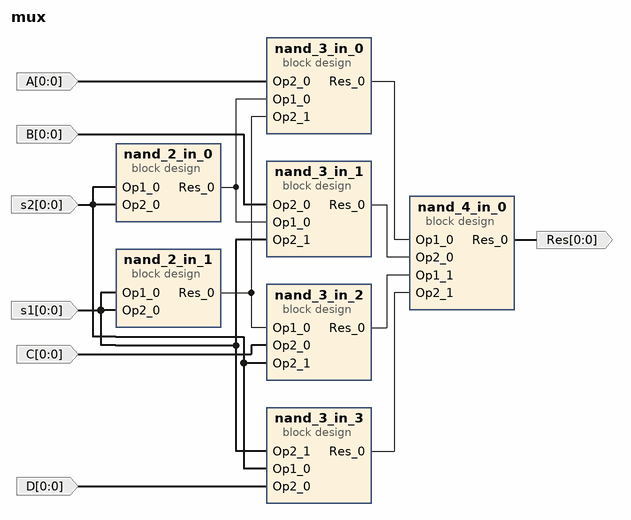
[diagram p0: block diagram of the top level]
# Vivado block design mux, xc7a100tcsg324-1, Vivado 2021.2
create_bd_design mux

create_bd_port -dir I -from 0 -to 0 C
create_bd_port -dir I -from 0 -to 0 B
create_bd_port -dir I -from 0 -to 0 A
create_bd_port -dir I -from 0 -to 0 D
create_bd_port -dir O -from 0 -to 0 Res
create_bd_port -dir I -from 0 -to 0 s2
create_bd_port -dir I -from 0 -to 0 s1

create_bd_cell -type container -reference nand_3_in nand_3_in_0
set_property -dict [list \
  CONFIG.ACTIVE_SIM_BD nand_3_in.bd \
  CONFIG.ACTIVE_SYNTH_BD nand_3_in.bd \
  CONFIG.ENABLE_DFX 0 \
  CONFIG.LIST_SIM_BD nand_3_in.bd \
  CONFIG.LIST_SYNTH_BD nand_3_in.bd \
  CONFIG.LOCK_PROPAGATE 0 \
] [get_bd_cells nand_3_in_0]
create_bd_cell -type container -reference nand_3_in nand_3_in_1
set_property -dict [list \
  CONFIG.ACTIVE_SIM_BD nand_3_in.bd \
  CONFIG.ACTIVE_SYNTH_BD nand_3_in.bd \
  CONFIG.ENABLE_DFX 0 \
  CONFIG.LIST_SIM_BD nand_3_in.bd \
  CONFIG.LIST_SYNTH_BD nand_3_in.bd \
  CONFIG.LOCK_PROPAGATE 0 \
] [get_bd_cells nand_3_in_1]
create_bd_cell -type container -reference nand_3_in nand_3_in_2
set_property -dict [list \
  CONFIG.ACTIVE_SIM_BD nand_3_in.bd \
  CONFIG.ACTIVE_SYNTH_BD nand_3_in.bd \
  CONFIG.ENABLE_DFX 0 \
  CONFIG.LIST_SIM_BD nand_3_in.bd \
  CONFIG.LIST_SYNTH_BD nand_3_in.bd \
  CONFIG.LOCK_PROPAGATE 0 \
] [get_bd_cells nand_3_in_2]
create_bd_cell -type container -reference nand_3_in nand_3_in_3
set_property -dict [list \
  CONFIG.ACTIVE_SIM_BD nand_3_in.bd \
  CONFIG.ACTIVE_SYNTH_BD nand_3_in.bd \
  CONFIG.ENABLE_DFX 0 \
  CONFIG.LIST_SIM_BD nand_3_in.bd \
  CONFIG.LIST_SYNTH_BD nand_3_in.bd \
  CONFIG.LOCK_PROPAGATE 0 \
] [get_bd_cells nand_3_in_3]
create_bd_cell -type container -reference nand_4_in nand_4_in_0
set_property -dict [list \
  CONFIG.ACTIVE_SIM_BD nand_4_in.bd \
  CONFIG.ACTIVE_SYNTH_BD nand_4_in.bd \
  CONFIG.ENABLE_DFX 0 \
  CONFIG.LIST_SIM_BD nand_4_in.bd \
  CONFIG.LIST_SYNTH_BD nand_4_in.bd \
  CONFIG.LOCK_PROPAGATE 0 \
] [get_bd_cells nand_4_in_0]
create_bd_cell -type container -reference nand_2_in nand_2_in_0
set_property -dict [list \
  CONFIG.ACTIVE_SIM_BD nand_2_in.bd \
  CONFIG.ACTIVE_SYNTH_BD nand_2_in.bd \
  CONFIG.ENABLE_DFX 0 \
  CONFIG.LIST_SIM_BD nand_2_in.bd \
  CONFIG.LIST_SYNTH_BD nand_2_in.bd \
  CONFIG.LOCK_PROPAGATE 0 \
] [get_bd_cells nand_2_in_0]
create_bd_cell -type container -reference nand_2_in nand_2_in_1
set_property -dict [list \
  CONFIG.ACTIVE_SIM_BD nand_2_in.bd \
  CONFIG.ACTIVE_SYNTH_BD nand_2_in.bd \
  CONFIG.ENABLE_DFX 0 \
  CONFIG.LIST_SIM_BD nand_2_in.bd \
  CONFIG.LIST_SYNTH_BD nand_2_in.bd \
  CONFIG.LOCK_PROPAGATE 0 \
] [get_bd_cells nand_2_in_1]

# ---- connections ----

connect_bd_net -net Op1_0_0_1 [get_bd_ports s2] \
  [get_bd_pins nand_2_in_0/Op1_0] [get_bd_pins nand_2_in_0/Op2_0] [get_bd_pins nand_3_in_3/Op1_0] \
  [get_bd_pins nand_3_in_2/Op2_1]
connect_bd_net -net Op1_0_1_1 [get_bd_ports s1] \
  [get_bd_pins nand_2_in_1/Op1_0] [get_bd_pins nand_2_in_1/Op2_0] [get_bd_pins nand_3_in_3/Op2_1] \
  [get_bd_pins nand_3_in_1/Op2_1]
connect_bd_net -net Op2_0_0_1 [get_bd_ports C] [get_bd_pins nand_3_in_2/Op2_0]
connect_bd_net -net Op2_0_1_1 [get_bd_ports B] [get_bd_pins nand_3_in_1/Op2_0]
connect_bd_net -net Op2_0_2_1 [get_bd_ports A] [get_bd_pins nand_3_in_0/Op2_0]
connect_bd_net -net Op2_0_3_1 [get_bd_ports D] [get_bd_pins nand_3_in_3/Op2_0]
connect_bd_net [get_bd_pins nand_2_in_0/Res_0] [get_bd_pins nand_3_in_0/Op1_0] [get_bd_pins nand_3_in_1/Op1_0]
connect_bd_net [get_bd_pins nand_2_in_1/Res_0] [get_bd_pins nand_3_in_0/Op2_1] [get_bd_pins nand_3_in_2/Op1_0]
connect_bd_net [get_bd_pins nand_3_in_0/Res_0] [get_bd_pins nand_4_in_0/Op1_0]
connect_bd_net [get_bd_pins nand_3_in_1/Res_0] [get_bd_pins nand_4_in_0/Op2_0]
connect_bd_net [get_bd_pins nand_3_in_2/Res_0] [get_bd_pins nand_4_in_0/Op1_1]
connect_bd_net [get_bd_pins nand_3_in_3/Res_0] [get_bd_pins nand_4_in_0/Op2_1]
connect_bd_net [get_bd_pins nand_4_in_0/Res_0] [get_bd_ports Res]

validate_bd_design
save_bd_design
